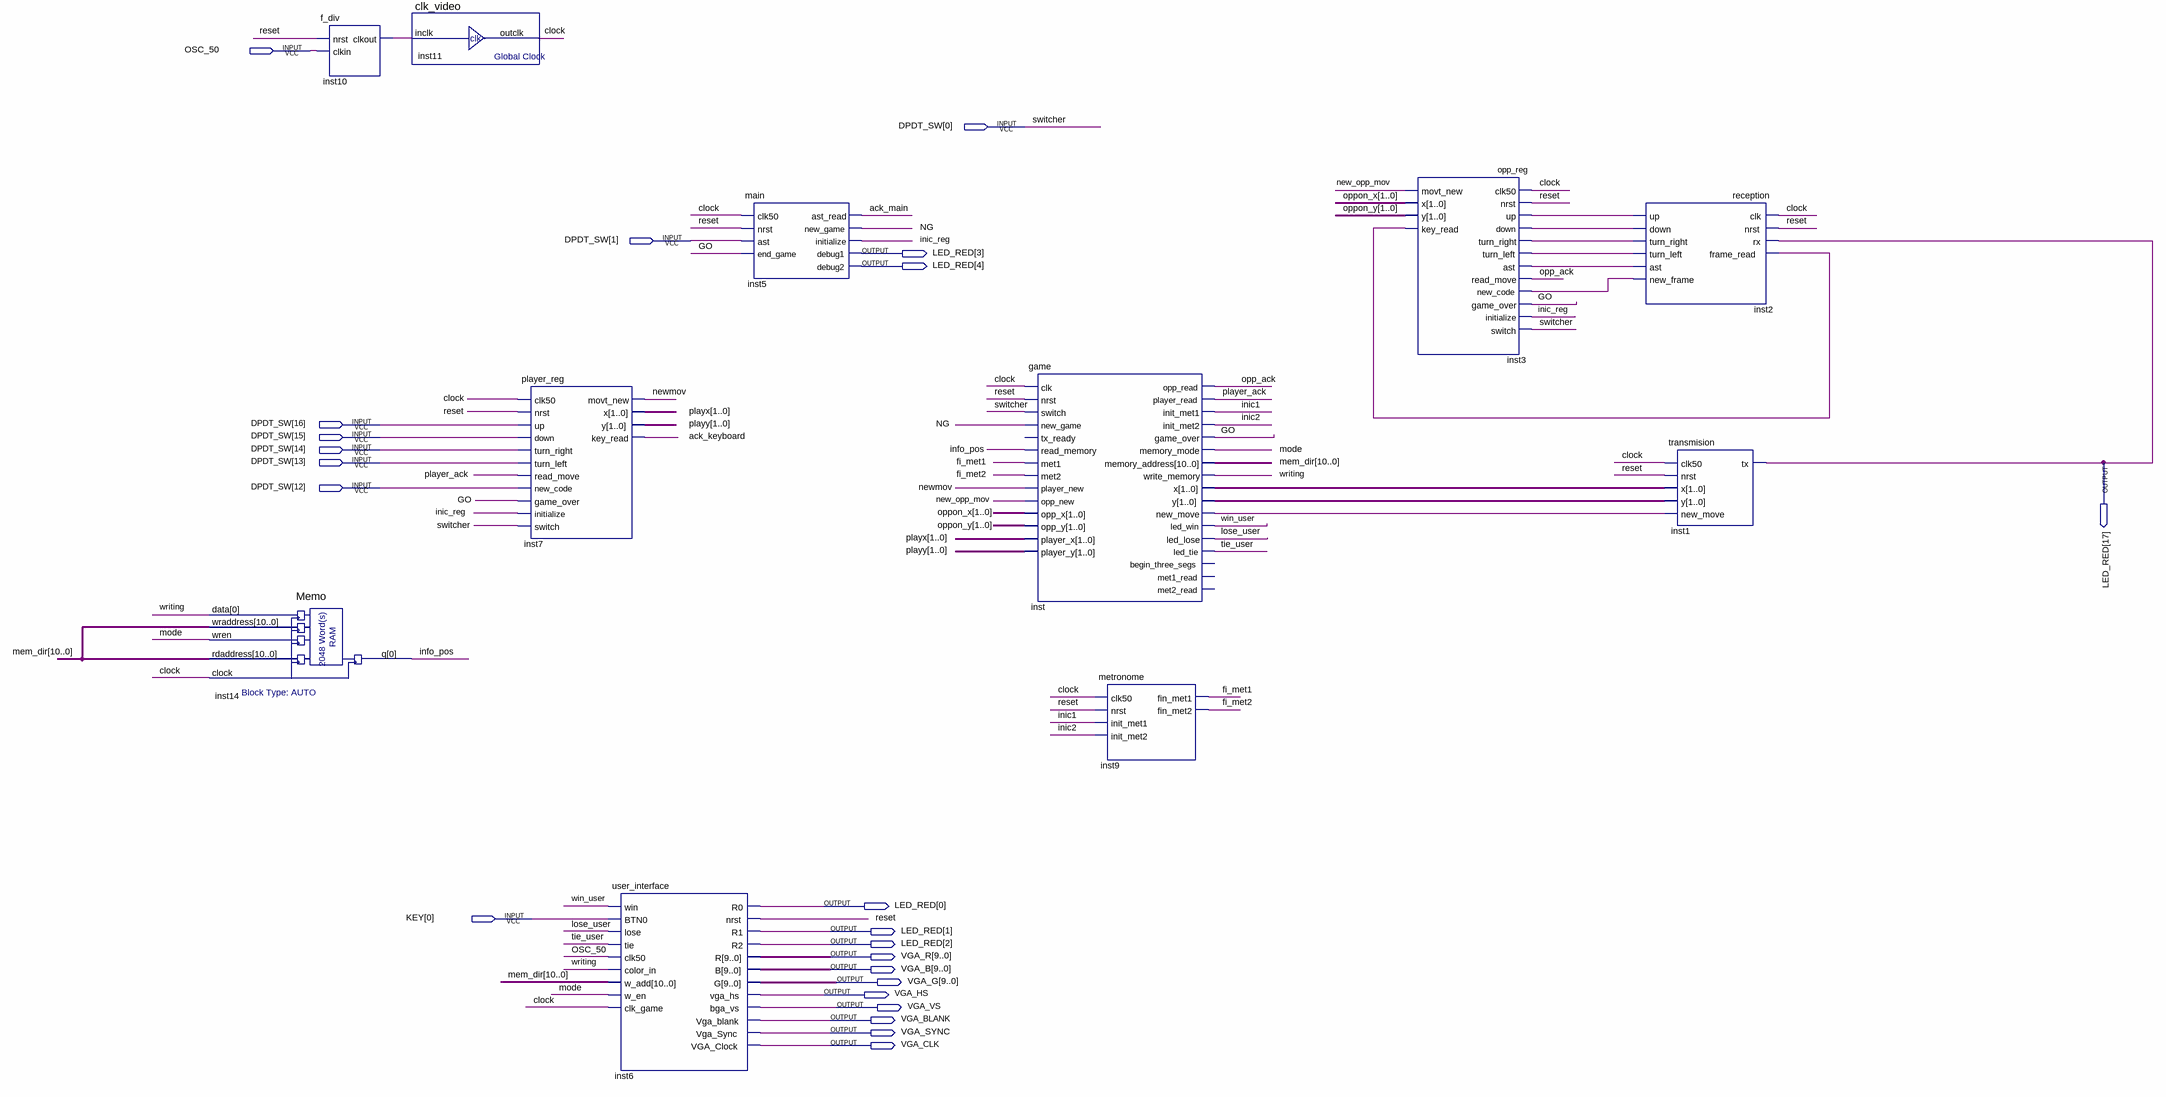
[diagram p0: schematic sheet]
// Quartus schematic final_sense_teclat.bdf as structural Verilog: 11 symbols, 23 pins
module final_sense_teclat (
  input  OSC_50,
  input  [16:0] DPDT_SW,
  input  [0:0] KEY,
  output [17:0] LED_RED,
  output [9:0] VGA_R,
  output [9:0] VGA_B,
  output [9:0] VGA_G,
  output VGA_HS,
  output VGA_VS,
  output VGA_BLANK,
  output VGA_SYNC,
  output VGA_CLK
);

  wire ack_keyboard, ack_main, clock, fi_met1, fi_met2, GO, info_pos, inic1, inic2, inic_reg, inst2_ast,
       inst2_down, inst2_new_frame, inst2_turn_left, inst2_turn_right, inst2_up, inst3_key_read,
       inst10_clkout, inst_new_move, lose_user, mode, new_opp_mov, newmov, NG, opp_ack, player_ack, reset,
       tie_user, win_user, writing;
  wire [1:0] inst_x, inst_y, oppon_x, oppon_y, playx, playy;
  wire [10:0] mem_dir;

  Memo inst14 (.data(writing), .wraddress(mem_dir), .wren(mode), .rdaddress(mem_dir), .clock(clock), .q(info_pos));
  f_div inst10 (.nrst(reset), .clkin(OSC_50), .clkout(inst10_clkout));
  clk_video inst11 (.inclk(inst10_clkout), .outclk(clock));
  player_reg inst7 (
    .clk50(clock), .nrst(reset), .up(DPDT_SW[16]), .down(DPDT_SW[15]), .turn_right(DPDT_SW[14]),
    .turn_left(DPDT_SW[13]), .read_move(player_ack), .new_code(DPDT_SW[12]), .game_over(GO),
    .initialize(inic_reg), .switch(DPDT_SW[0]), .movt_new(newmov), .x(playx), .y(playy),
    .key_read(ack_keyboard));
  user_interface inst6 (
    .win(win_user), .BTN0(KEY[0]), .lose(lose_user), .tie(tie_user), .clk50(OSC_50), .color_in(writing),
    .w_add(mem_dir), .w_en(mode), .clk_game(clock), .R0(LED_RED[0]), .nrst(reset), .R1(LED_RED[1]),
    .R2(LED_RED[2]), .R(VGA_R), .B(VGA_B), .G(VGA_G), .vga_hs(VGA_HS), .bga_vs(VGA_VS),
    .Vga_blank(VGA_BLANK), .Vga_Sync(VGA_SYNC), .VGA_Clock(VGA_CLK));
  main inst5 (
    .clk50(clock), .nrst(reset), .ast(DPDT_SW[1]), .end_game(GO), .ast_read(ack_main), .new_game(NG),
    .initialize(inic_reg), .debug1(LED_RED[3]), .debug2(LED_RED[4]));
  game inst (
    .clk(clock), .nrst(reset), .switch(DPDT_SW[0]), .new_game(NG), .read_memory(info_pos), .met1(fi_met1),
    .met2(fi_met2), .player_new(newmov), .opp_new(new_opp_mov), .opp_x(oppon_x), .opp_y(oppon_y),
    .player_x(playx), .player_y(playy), .opp_read(opp_ack), .player_read(player_ack), .init_met1(inic1),
    .init_met2(inic2), .game_over(GO), .memory_mode(mode), .memory_address(mem_dir), .write_memory(writing),
    .x(inst_x), .y(inst_y), .new_move(inst_new_move), .led_win(win_user), .led_lose(lose_user),
    .led_tie(tie_user));  // open: tx_ready, begin_three_segs, met1_read, met2_read
  metronome inst9 (
    .clk50(clock), .nrst(reset), .init_met1(inic1), .init_met2(inic2), .fin_met1(fi_met1), .fin_met2(fi_met2));
  opp_reg inst3 (
    .clk50(clock), .nrst(reset), .up(inst2_up), .down(inst2_down), .turn_right(inst2_turn_right),
    .turn_left(inst2_turn_left), .ast(inst2_ast), .read_move(opp_ack), .new_code(inst2_new_frame),
    .game_over(GO), .initialize(inic_reg), .switch(DPDT_SW[0]), .movt_new(new_opp_mov), .x(oppon_x),
    .y(oppon_y), .key_read(inst3_key_read));
  reception inst2 (
    .clk(clock), .nrst(reset), .rx(LED_RED[17]), .frame_read(inst3_key_read), .up(inst2_up),
    .down(inst2_down), .turn_right(inst2_turn_right), .turn_left(inst2_turn_left), .ast(inst2_ast),
    .new_frame(inst2_new_frame));
  transmision inst1 (.clk50(clock), .nrst(reset), .new_move(inst_new_move), .x(inst_x), .y(inst_y), .tx(LED_RED[17]));

  // Other names for the same wires on the sheet: switcher = DPDT_SW[0]
endmodule
